# EAGLE design HydraBus_1_0_Shield_Template_Rev0 (EAGLE 6.5.0)
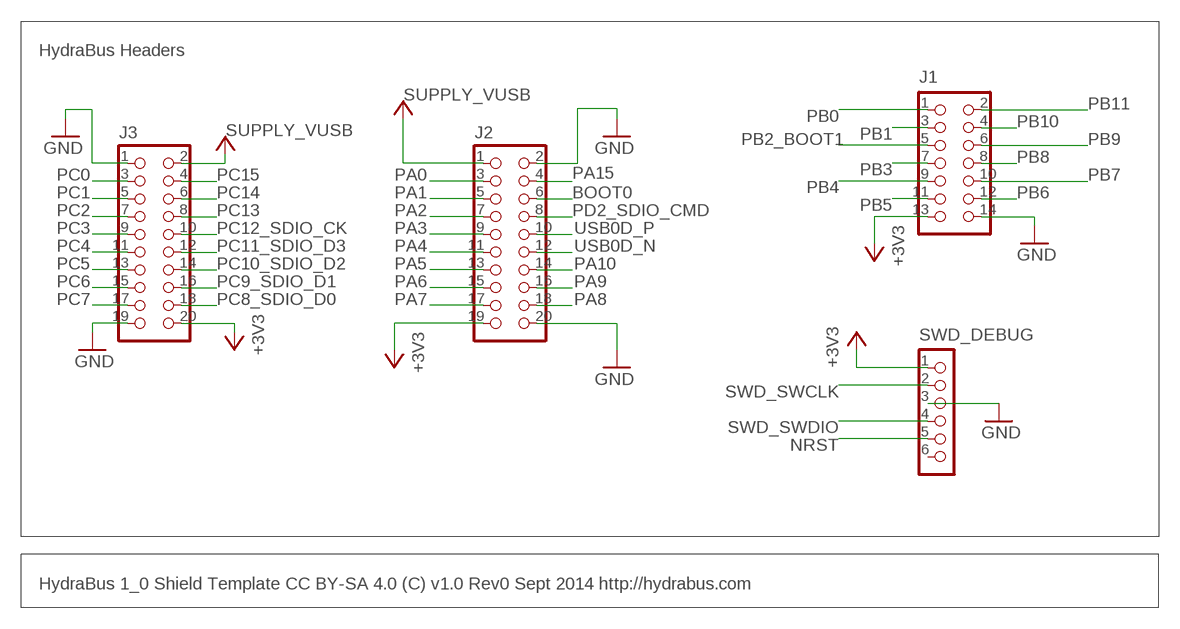
[diagram p0: schematic, sheet 1]

## Parts
J1  HYDRABUS_SHIELD_CON_HEADER_2X07  [HYDRABUS_SHIELD_M2X7]
J2  HYDRABUS_SHIELD_CON_HEADER_2X10  [HYDRABUS_SHIELD_M2X10]
J3  HYDRABUS_SHIELD_CON_HEADER_2X10  [HYDRABUS_SHIELD_M2X10]
SWD_DEBUG  HYDRABUS_SHIELD_CON_HEADER_1X06  [HYDRABUS_SHIELD_M1X6]

## Nets
+3V3 [VDD]: J1.13 J2.19 J3.20 SWD_DEBUG.1
BOOT0: J2.6
GND: J1.14 J2.2 J2.20 J3.1 J3.19 SWD_DEBUG.3
NRST: SWD_DEBUG.5
PA0: J2.3
PA1: J2.5
PA2: J2.7
PA3: J2.9
PA4: J2.11
PA5: J2.13
PA6: J2.15
PA7: J2.17
PA8: J2.18
PA9: J2.16
PA10: J2.14
PA15: J2.4
PB0: J1.1
PB1: J1.3
PB2_BOOT1: J1.5
PB3: J1.7
PB4: J1.9
PB5: J1.11
PB6: J1.12
PB7: J1.10
PB8: J1.8
PB9: J1.6
PB10: J1.4
PB11: J1.2
PC0: J3.3
PC1: J3.5
PC2: J3.7
PC3: J3.9
PC4: J3.11
PC5: J3.13
PC6: J3.15
PC7: J3.17
PC8_SDIO_D0: J3.18
PC9_SDIO_D1: J3.16
PC10_SDIO_D2: J3.14
PC11_SDIO_D3: J3.12
PC12_SDIO_CK: J3.10
PC13: J3.8
PC14: J3.6
PC15: J3.4
PD2_SDIO_CMD: J2.8
SWD_SWCLK: SWD_DEBUG.2
SWD_SWDIO: SWD_DEBUG.4
USB0D_N: J2.12
USB0D_P: J2.10
VUSB [POWER]: J2.1 J3.2 ; supply symbol labelled SUPPLY_VUSB
Unconnected: SWD_DEBUG.6

## Notes on the sheet
- HydraBus Headers
- HydraBus 1_0 Shield Template CC BY-SA 4.0 (C) v1.0 Rev0 Sept 2014 http://hydrabus.com

## Library data of the parts
J1 = hydrabus_shield:HYDRABUS_SHIELD_CON_HEADER_2X07: 2x7 Pin header
J2 J3 = hydrabus_shield:HYDRABUS_SHIELD_CON_HEADER_2X10: 2x10 Pin header
SWD_DEBUG = hydrabus_shield:HYDRABUS_SHIELD_CON_HEADER_1X06: SWD Header 1x6 Pin header

## Net classes
0 default: width 0.203 mm, drill 0.33 mm, clearance 0.152 mm
1 POWER: width 0.203 mm, drill 0.33 mm, clearance 0.152 mm
2 VDD: width 0.254 mm, drill 0.33 mm, clearance 0.152 mm

## Board
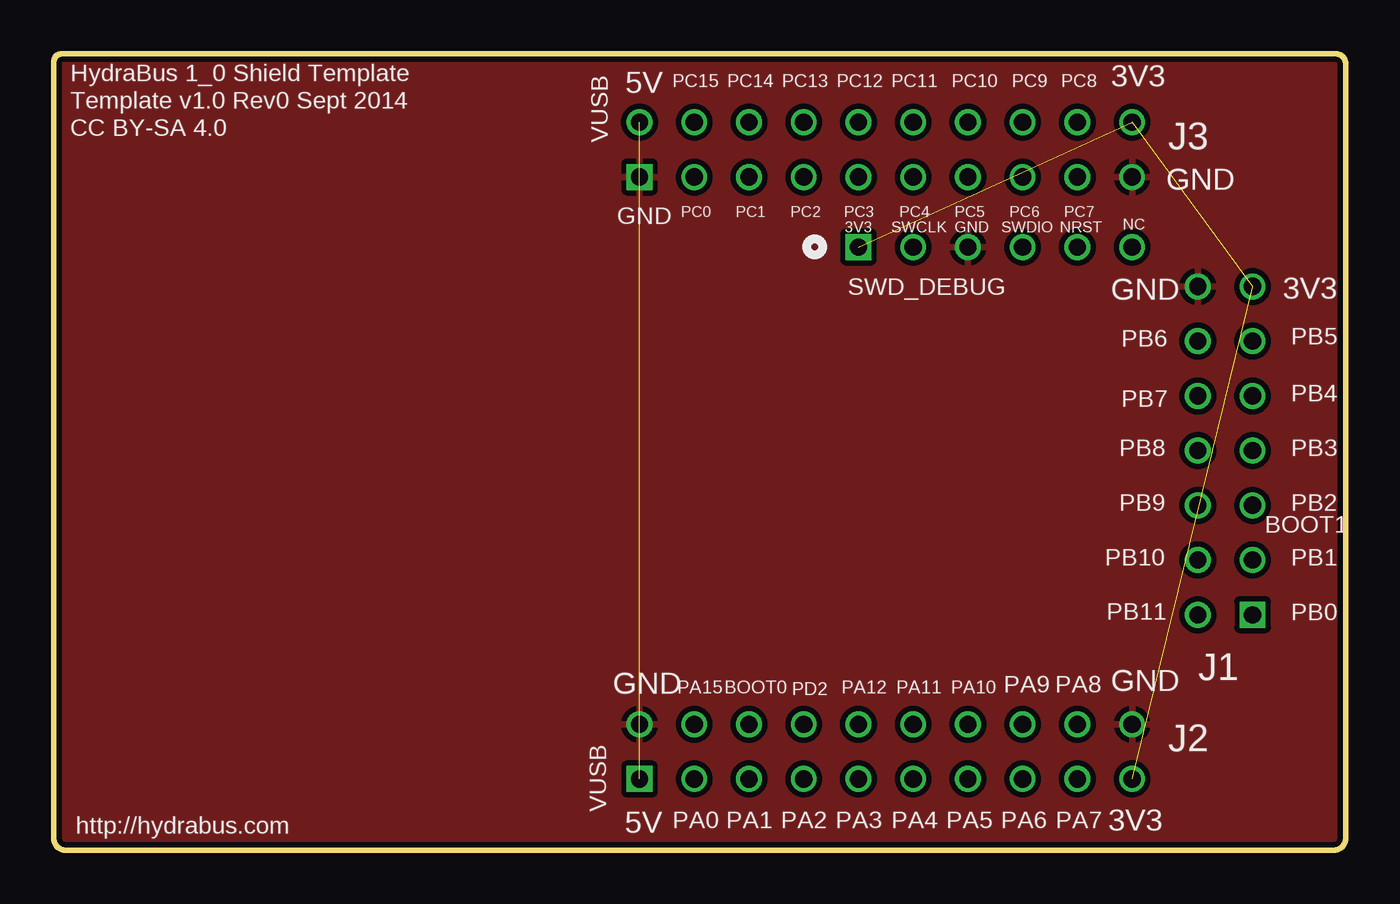
[diagram p1: board, top side]
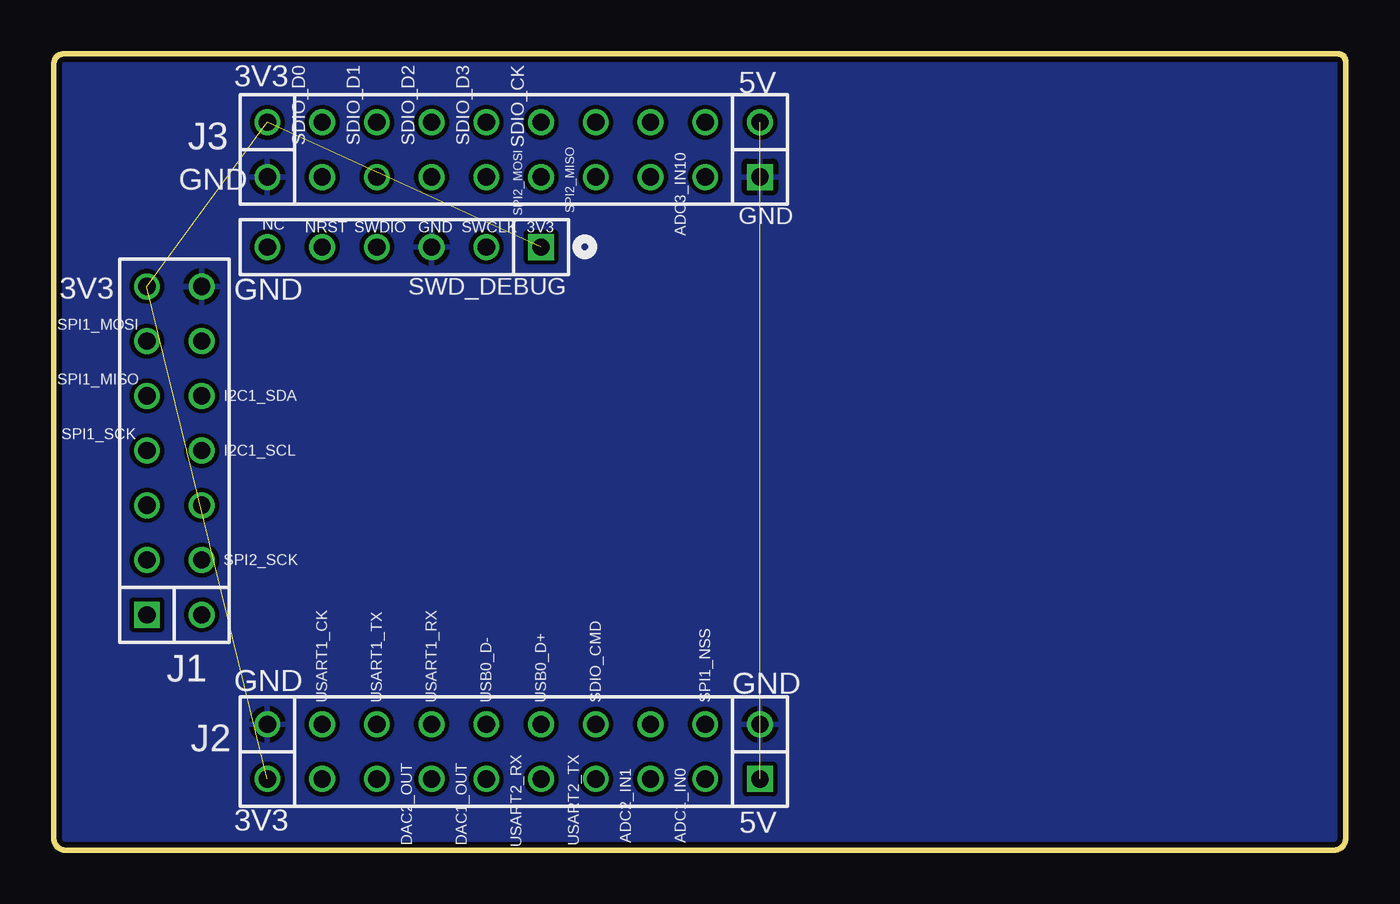
[diagram p2: board, bottom side, seen from below]

Size 59.94 x 36.96 mm. Coordinates in mm from the lower left corner, seen from the top.
Outline: 59.41,0 0.52,0 arc-90 0,0.52 0,36.6 arc-90 0.36,36.96 59.49,36.96 arc-90 59.94,36.5 59.94,0.54 arc-90 59.41,0
Copper layers (1*16): Top 0.035mm / dielectric 0.2mm / Bottom 0.035mm
Design rules "SeeedStudio_DRU_no_angle_20130527_2layers": minimum track width 6mil, minimum drill 12mil, track to track 6mil, track to pad 6mil, pad to pad 6mil, via to via 6mil, smd to smd 0mil, copper to edge 10mil, drill to drill 10mil, minimum pad ring 6mil, minimum via ring 6mil, stop-mask expansion 2mil, vias tented up to drill 25mil, thermal gap 10mil

### Footprints (pad centres in the part's own frame; a part is rotated, then mirrored left to right if it is on the bottom)
HYDRABUS_SHIELD_M2X7 = drill 0.8 square: 1 -7.62,-1.27 | drill 0.8: 2 -7.62,1.27; 3 -5.08,-1.27; 4 -5.08,1.27; 5 -2.54,-1.27; 6 -2.54,1.27; 7 0,-1.27; 8 0,1.27; 9 2.54,-1.27; 10 2.54,1.27; 11 5.08,-1.27; 12 5.08,1.27; 13 7.62,-1.27; 14 7.62,1.27
HYDRABUS_SHIELD_M2X10 = drill 0.8 square: 1 -11.43,-1.27 | drill 0.8: 2 -11.43,1.27; 3 -8.89,-1.27; 4 -8.89,1.27; 5 -6.35,-1.27; 6 -6.35,1.27; 7 -3.81,-1.27; 8 -3.81,1.27; 9 -1.27,-1.27; 10 -1.27,1.27; 11 1.27,-1.27; 12 1.27,1.27; 13 3.81,-1.27; 14 3.81,1.27; 15 6.35,-1.27; 16 6.35,1.27; 17 8.89,-1.27; 18 8.89,1.27; 19 11.43,-1.27; 20 11.43,1.27
HYDRABUS_SHIELD_M1X6 = drill 0.8 square: 1 0,0 | drill 0.8: 2 2.54,0; 3 5.08,0; 4 7.62,0; 5 10.16,0; 6 12.7,0

### Placement (x,y rotation side)
J1  54.36,18.54 90 top
J2  38.61,4.57 0 top
J3  38.61,32.51 0 top
SWD_DEBUG  37.34,27.99 0 top

### Tracks (layer width: path | path; a pad name or v marks a point on that pad's centre or on a via)
+3V3  (3 unrouted)
GND
  pour Top (isolate 0.254): -1,38.22 60.84,38.22 60.84,-1 -1,-1
  pour Bottom (isolate 0.203): -2.02,39.86 62.13,39.86 62,-2 -2,-2
VUSB  (1 unrouted)

### Text on the board
tNames: HydraBus 1_0 Shield Template | 5V | PC15 | PC14 | PC13 | PC12 | PC11 | PC10 | PC9 | PC8 | 3V3 | Template v1.0 Rev0 Sept 2014 | CC BY-SA 4.0 | VUSB | J3 | GND | GND | PC0 | PC1 | PC2 | PC3 | 3V3 | SWCLK | PC4 | GND | PC5 | SWDIO | PC6 | NRST | PC7 | NC | GND | 3V3 | PB6 | PB5 | PB7 | PB4 | PB8 | PB3 | PB9 | PB2 | BOOT1 | PB10 | PB1 | PB11 | PB0 | PA15 | BOOT0 | PD2 | PA12 | PA11 | PA10 | PA9 | PA8 | J1 | GND | GND | J2 | VUSB | http://hydrabus.com | 5V | PA0 | PA1 | PA2 | PA3 | PA4 | PA5 | PA6 | PA7 | 3V3
bNames: SDIO_CK | SDIO_D3 | SDIO_D2 | SDIO_D1 | SDIO_D0 | 5V | 3V3 | SPI2_MISO | SPI2_MOSI | ADC3_IN10 | GND | GND | 3V3 | SWCLK | GND | SWDIO | NRST | NC | SWD_DEBUG | GND | 3V3 | SPI1_MOSI | SPI1_MISO | I2C1_SDA | SPI1_SCK | I2C1_SCL | SPI2_SCK | GND | SPI1_NSS | SDIO_CMD | USB0_D+ | USB0_D- | USART1_RX | USART1_TX | USART1_CK | GND | ADC1_IN0 | ADC2_IN1 | USART2_TX | USART2_RX | DAC1_OUT | DAC2_OUT | 5V | 3V3